# Altium schematic sheet ICD_ADAPTER.SchDoc
size Tabloid
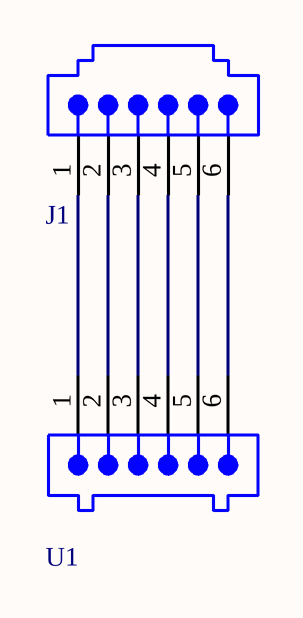
[diagram p0: ICD_ADAPTER.SchDoc]

## Parts
J1  CONN MOD JACK 6-6 RT/A PCB 50AU  [43202-6101]  (value not drawn)
U1  1786446  [1786446]  (value not drawn)

## Nets
NetJ1_1: J1.1 U1.1
NetJ1_2: J1.2 U1.2
NetJ1_3: J1.3 U1.3
NetJ1_4: J1.4 U1.4
NetJ1_5: J1.5 U1.5
NetJ1_6: J1.6 U1.6

## Library data of the parts
J1 = Microchip ICD2: Manufacturer: Tyco Electronics Amp; Manufacturer Part Number: 5555165-1; Source Part Number: A31422-ND; Source: Digikey; Value: CONN MOD JACK 6-6 RT/A PCB 50AU
U1 = 1786446: Source: Digikey